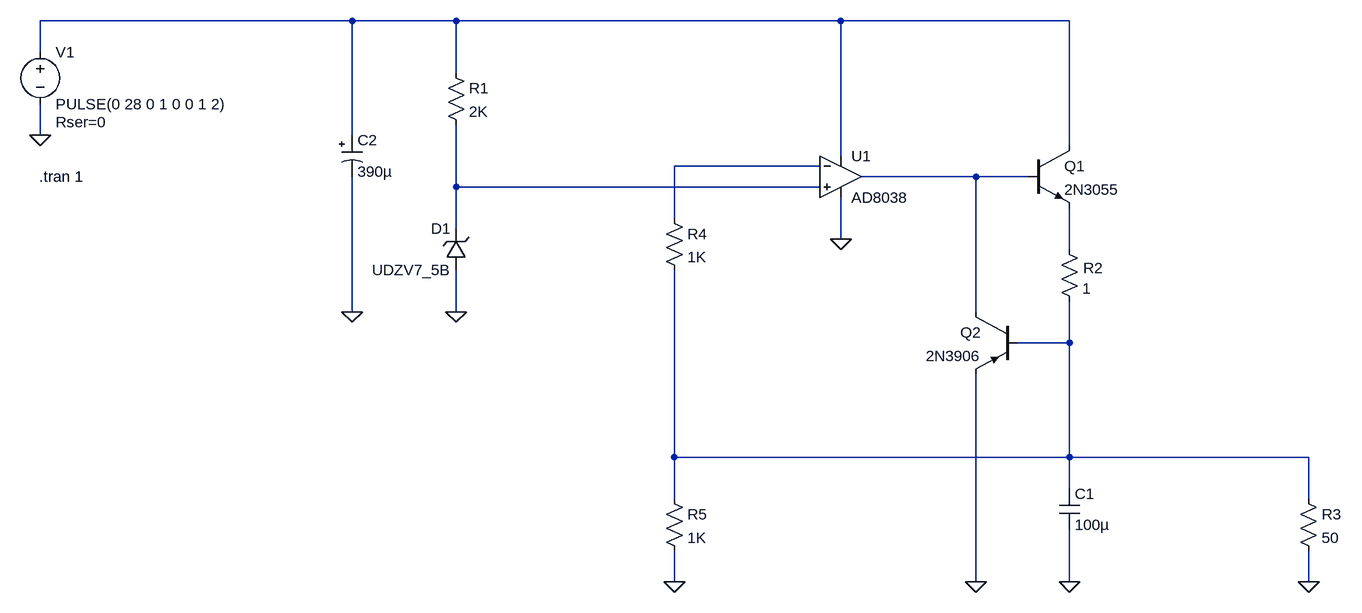
[diagram p0: schematic LinearRegulatorCurrentLimit.asc]
LinearRegulatorCurrentLimit.asc, the LTspice schematic file:
Version 4
SHEET 1 1064 836
WIRE -864 -64 -1344 -64
WIRE -704 -64 -864 -64
WIRE -112 -64 -704 -64
WIRE 240 -64 -112 -64
WIRE -1344 -16 -1344 -64
WIRE -704 16 -704 -64
WIRE -1344 112 -1344 64
WIRE -864 112 -864 -64
WIRE 240 128 240 -64
WIRE -112 144 -112 -64
WIRE -144 160 -368 160
WIRE 96 176 -80 176
WIRE 176 176 96 176
WIRE -704 192 -704 96
WIRE -144 192 -704 192
WIRE -368 240 -368 160
WIRE -704 256 -704 192
WIRE -112 272 -112 208
WIRE 240 288 240 224
WIRE -864 384 -864 176
WIRE -704 384 -704 320
WIRE 96 384 96 176
WIRE 240 432 240 368
WIRE 240 432 160 432
WIRE -368 608 -368 320
WIRE 240 608 240 432
WIRE 240 608 -368 608
WIRE 608 608 240 608
WIRE 240 656 240 608
WIRE -368 672 -368 608
WIRE 608 672 608 608
WIRE -368 800 -368 752
WIRE 96 800 96 480
WIRE 240 800 240 720
WIRE 608 800 608 752
FLAG -112 272 0
FLAG -704 384 0
FLAG -1344 112 0
FLAG 608 800 0
FLAG -368 800 0
FLAG 240 800 0
FLAG -864 384 0
FLAG 96 800 0
SYMBOL npn 176 128 R0
SYMATTR InstName Q1
SYMATTR Value 2N3055
SYMBOL Opamps\\AD8038 -112 112 R0
SYMATTR InstName U1
SYMBOL res -720 0 R0
SYMATTR InstName R1
SYMATTR Value 2K
SYMATTR SpiceLine tol=1 pwr=0.1
SYMBOL voltage -1344 -32 R0
WINDOW 123 0 0 Left 0
WINDOW 39 24 124 Left 2
SYMATTR InstName V1
SYMATTR Value PULSE(0 28 0 1 0 0 1 2)
SYMATTR SpiceLine Rser=0
SYMBOL res 592 656 R0
SYMATTR InstName R3
SYMATTR Value 50
SYMATTR SpiceLine tol=1 pwr=0.1
SYMBOL res -384 224 R0
SYMATTR InstName R4
SYMATTR Value 1K
SYMATTR SpiceLine tol=1 pwr=0.1
SYMBOL res -384 656 R0
SYMATTR InstName R5
SYMATTR Value 1K
SYMATTR SpiceLine tol=1 pwr=0.1
SYMBOL zener -688 320 R180
WINDOW 0 24 64 Left 2
WINDOW 3 24 0 Left 2
SYMATTR InstName D1
SYMATTR Value UDZV7_5B
SYMATTR Description Diode
SYMATTR Type diode
SYMBOL cap 224 656 R0
SYMATTR InstName C1
SYMATTR Value 100µ
SYMATTR SpiceLine V=20 Irms=3.5 Rser=0.0106773 Lser=3.60666n mfg="Würth Elektronik" pn="875115452003 WCAP-PSHP 8 x 8,7" type="Al polymer"
SYMBOL polcap -880 112 R0
WINDOW 3 24 56 Left 2
SYMATTR InstName C2
SYMATTR Value 390µ
SYMATTR Description Capacitor
SYMATTR Type cap
SYMATTR SpiceLine V=50 Irms=1.27 Rser=0.084 Lser=0 mfg="Panasonic" pn="ECA1HFQ391" type="Al electrolytic"
SYMBOL res 224 272 R0
WINDOW 0 37 45 Left 2
SYMATTR InstName R2
SYMATTR Value 1
SYMATTR SpiceLine tol=1 pwr=0.1
SYMBOL pnp 160 384 M0
SYMATTR InstName Q2
SYMATTR Value 2N3906
TEXT -1346 176 Left 2 !.tran 1

The netlist it stands for:
* LinearRegulatorCurrentLimit.asc
Q1 N001 N003 N005 0 2N3055
XU1 N004 N002 N001 0 N003 AD8038  ; pins In+ In- V+ V- OUT
R1 N001 N004 2K tol=1 pwr=0.1
V1 N001 0 PULSE(0 28 0 1 0 0 1 2) Rser=0
R3 N006 0 50 tol=1 pwr=0.1
R4 N002 N006 1K tol=1 pwr=0.1
R5 N006 0 1K tol=1 pwr=0.1
D1 0 N004 UDZV7_5B
C1 N006 0 100µ V=20 Irms=3.5 Rser=0.0106773 Lser=3.60666n mfg="Würth Elektronik" pn="875115452003 WCAP-PSHP 8 x 8,7" type="Al polymer"
C2 N001 0 390µ V=50 Irms=1.27 Rser=0.084 Lser=0 mfg="Panasonic" pn="ECA1HFQ391" type="Al electrolytic"
R2 N005 N006 1 tol=1 pwr=0.1
Q2 N003 N006 0 0 2N3906
.model D D
.lib standard.dio
.model NPN NPN
.model PNP PNP
.lib standard.bjt
.tran 1
.backanno
.end